# Altium project HomeGear_IAQ_Module.PrjPcb
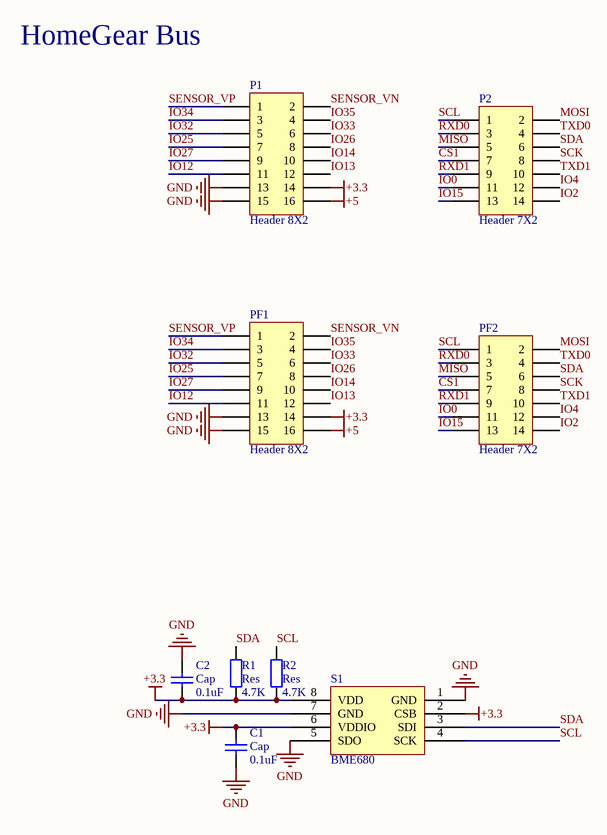
[diagram p0: Sheet.SchDoc]
1 sheet, 9 parts. Net scope: global (net labels, ports and power ports of the same name join across sheets).
Board file: PCB.PcbDoc

## Sheet Sheet.SchDoc
size A4

### Parts
C1  Cap  value 0.1uF  [MY0603]
C2  Cap  value 0.1uF  [MY0603]
P1  Header 8X2  [SMD_PIN_HDR8x2_2.0MM]
P2  Header 7X2  [SMD_PIN_HDR7x2_2.0MM]
PF1  Header 8X2  [SMD_FEM_HDR8x2_2.0MM]
PF2  Header 7X2  [SMD_FEM_HDR7x2_2.0MM]
R1  Res  value 4.7K  [MY0603]
R2  Res  value 4.7K  [MY0603]
S1  BME680  [LGA-8]

### Nets
+3.3: C1.2 C2.1 P1.14 PF1.14 R1.1 R2.1 S1.2(CSB) S1.6(VDDIO) S1.8(VDD)
+5: P1.16 PF1.16
GND: C1.1 C2.2 P1.13 P1.15 PF1.13 PF1.15 S1.1(GND) S1.5(SDO) S1.7(GND)
CS1: P2.7 PF2.7
IO0: P2.11 PF2.11
IO2: P2.14 PF2.14
IO4: P2.12 PF2.12
IO12: P1.11 PF1.11
IO13: P1.12 PF1.12
IO14: P1.10 PF1.10
IO15: P2.13 PF2.13
IO25: P1.7 PF1.7
IO26: P1.8 PF1.8
IO27: P1.9 PF1.9
IO32: P1.5 PF1.5
IO33: P1.6 PF1.6
IO34: P1.3 PF1.3
IO35: P1.4 PF1.4
MISO: P2.5 PF2.5
MOSI: P2.2 PF2.2
RXD0: P2.3 PF2.3
RXD1: P2.9 PF2.9
SCK: P2.8 PF2.8
SCL: P2.1 PF2.1 R2.2 S1.4(SCK)
SDA: P2.6 PF2.6 R1.2 S1.3(SDI)
SENSOR_VN: P1.2 PF1.2
SENSOR_VP: P1.1 PF1.1
TXD0: P2.4 PF2.4
TXD1: P2.10 PF2.10

### Notes on the sheet
- HomeGear Bus

### Library data of the parts
C1 C2 = Cap: Capacitor; Published: 8-Jun-2000; LatestRevisionDate: 17-Jul-2002; LatestRevisionNote: Re-released for DXP Platform.; PackageReference: RAD-0.3; Publisher: Altium Limited; PackageDescription: Radial Cap, Thru-Hole; 2 Leads; 0.3 in Pin Spacing
P1 PF1 = Header 8X2: Header, 8-Pin, Dual row; LatestRevisionDate: 17-Jul-2002; LatestRevisionNote: Re-released for DXP Platform.; Publisher: Altium Limited
P2 PF2 = Header 7X2: Header, 7-Pin, Dual row; LatestRevisionDate: 17-Jul-2002; LatestRevisionNote: Re-released for DXP Platform.; Publisher: Altium Limited
R1 R2 = Res2: Resistor; Published: 8-Jun-2000; LatestRevisionDate: 17-Jul-2002; LatestRevisionNote: Re-released for DXP Platform.; PackageReference: AXIAL-0.4; Publisher: Altium Limited; PackageDescription: Axial Device, Thru-Hole; 2 Leads; 0.4 in Pin Spacing